# Altium schematic sheet LowLevelRv2.SchDoc
size A4
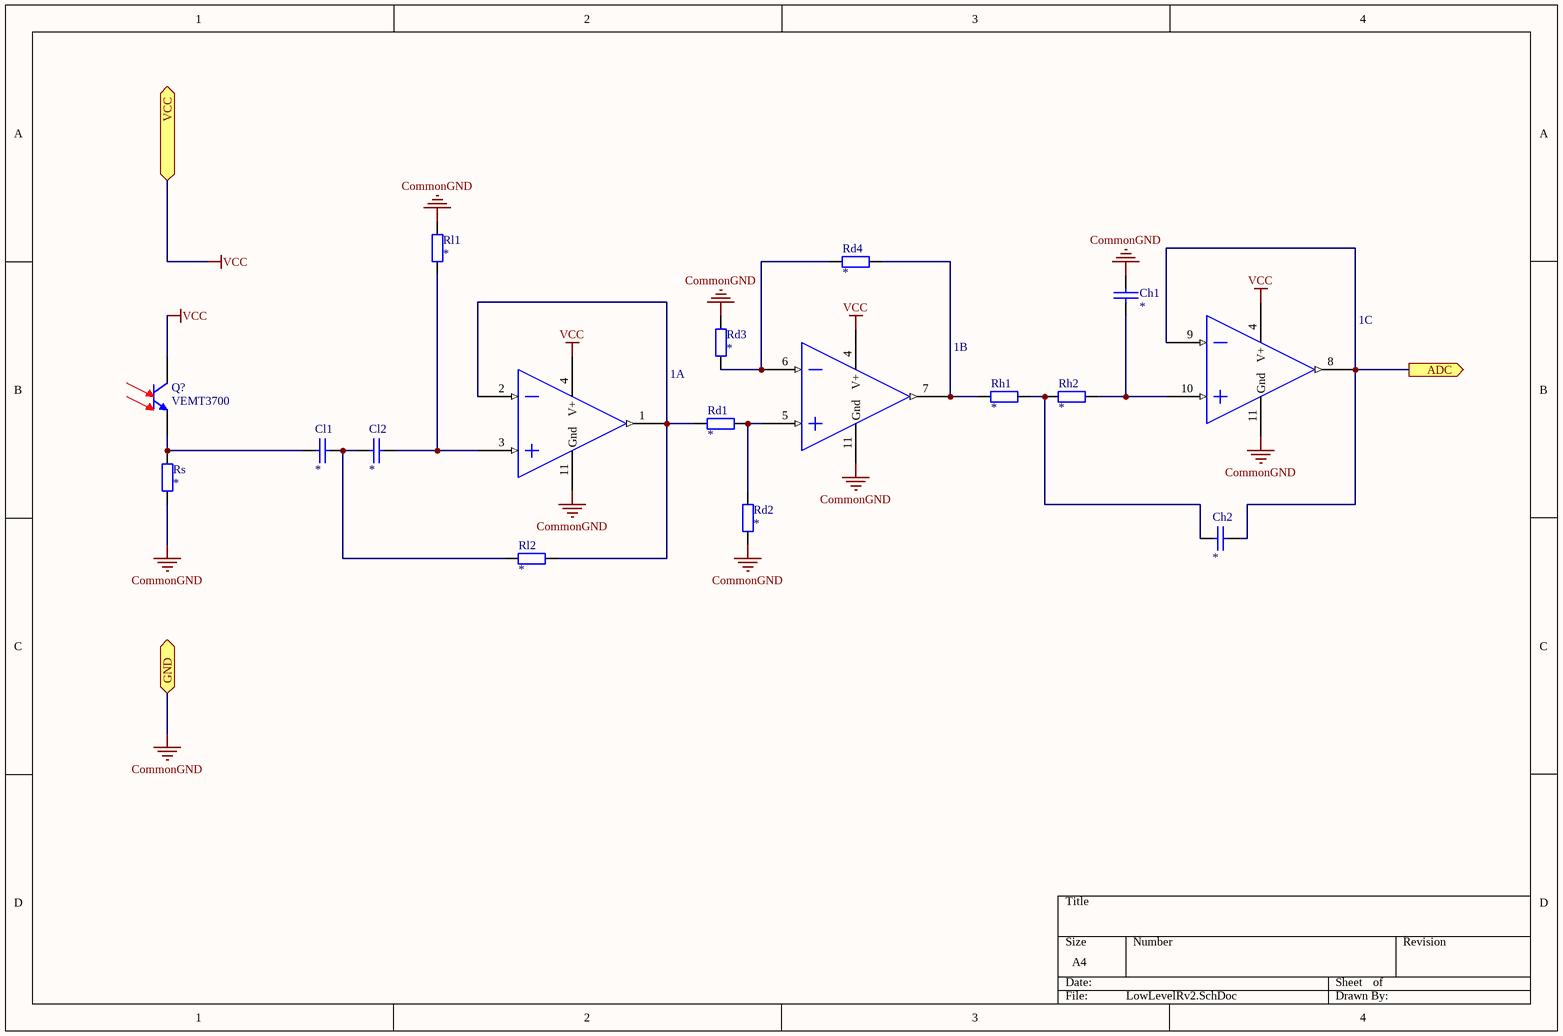
[diagram p0: LowLevelRv2.SchDoc]

## Parts
1  LM324N  [ECE-DIP14TH]  (value not drawn)  (parts A,B,C of 4)
Ch1  *  [FILM CAP-0.2]
Ch2  *  [FILM CAP-0.2]
Cl1  *  [FILM CAP-0.2]
Cl2  *  [FILM CAP-0.2]
Q?  VEMT3700  [VEMT3700]
Rd1  *  [AXIAL-0.4]
Rd2  *  [AXIAL-0.4]
Rd3  *  [AXIAL-0.4]
Rd4  *  [AXIAL-0.4]
Rh1  *  [AXIAL-0.4]
Rh2  *  [AXIAL-0.4]
Rl1  *  [AXIAL-0.4]
Rl2  *  [AXIAL-0.4]
Rs  *  [AXIAL-0.4]

## Ports
ADC (out), GND, VCC

## Nets
CommonGND: 1.11(Gnd) Ch1.1 Rd2.1 Rd3.2 Rl1.1 Rs.1 ; port GND
VCC: 1.4(V+) Q?.1(C) ; port VCC
ADC: 1.8(OUT3) 1.9(IN3(-)) Ch2.1 ; port ADC
Net1_1: 1.1(OUT1) 1.2(IN1(-)) Rd1.1 Rl2.2
Net1_3: 1.3(IN1(+)) Cl2.2 Rl1.2
Net1_5: 1.5(IN2+)) Rd1.2 Rd2.2
Net1_6: 1.6(IN2(-)) Rd3.1 Rd4.1
Net1_7: 1.7(OUT2) Rd4.2 Rh1.1
Net1_10: 1.10(IN3(+)) Ch1.2 Rh2.2
NetCh2_2: Ch2.2 Rh1.2 Rh2.1
NetCl1_1: Cl1.1 Q?.2(E) Rs.2
NetCl1_2: Cl1.2 Cl2.1 Rl2.1

## Library data of the parts
1 = OPA000002: IC OPAMP LM324 QUAD TH; Manufactuer: Texas instruments; Assembly Method: Through hole; Item Type: Item; Path: ece/ts/Lists/Stock Inventory; UoA Stock#: OPA000002; Value: LM324N; Size/Package: DIP14; Manufacturer-PN: LM324N; Datasheet Link: http://share.engineering.auckland.ac.nz/ece/ts/Student%20Documents/LM324.pdf; Supplier1: Digikey; Supplier1-PN: 296-1391-5-ND; Supplier2: Active Components; Supplier2-PN: LM324N; Category: OpAmp; Status: Active
Ch1 Ch2 Cl1 Cl2 = CAP: Capacitor Non Polarised Through Hole; Value: *
Q? = VEMT3700: Silicon NPN Phototransistor
Rd1-Rd4 Rh1 Rh2 Rl1 Rl2 Rs = Res: Through Hole Resistor; Published: 8-Jun-2000; LatestRevisionDate: 17-Jul-2002; LatestRevisionNote: Re-released for DXP Platform.; PackageReference: AXIAL-0.4; Publisher: Altium Limited; Value: *; ComponentLink1Description: http://www.royalohm.com/pdf/product2017/PrecisionMetalMF.pdf